# Altium schematic sheet Control.SchDoc
size A; SheetNumber: 1; SheetTotal: 1
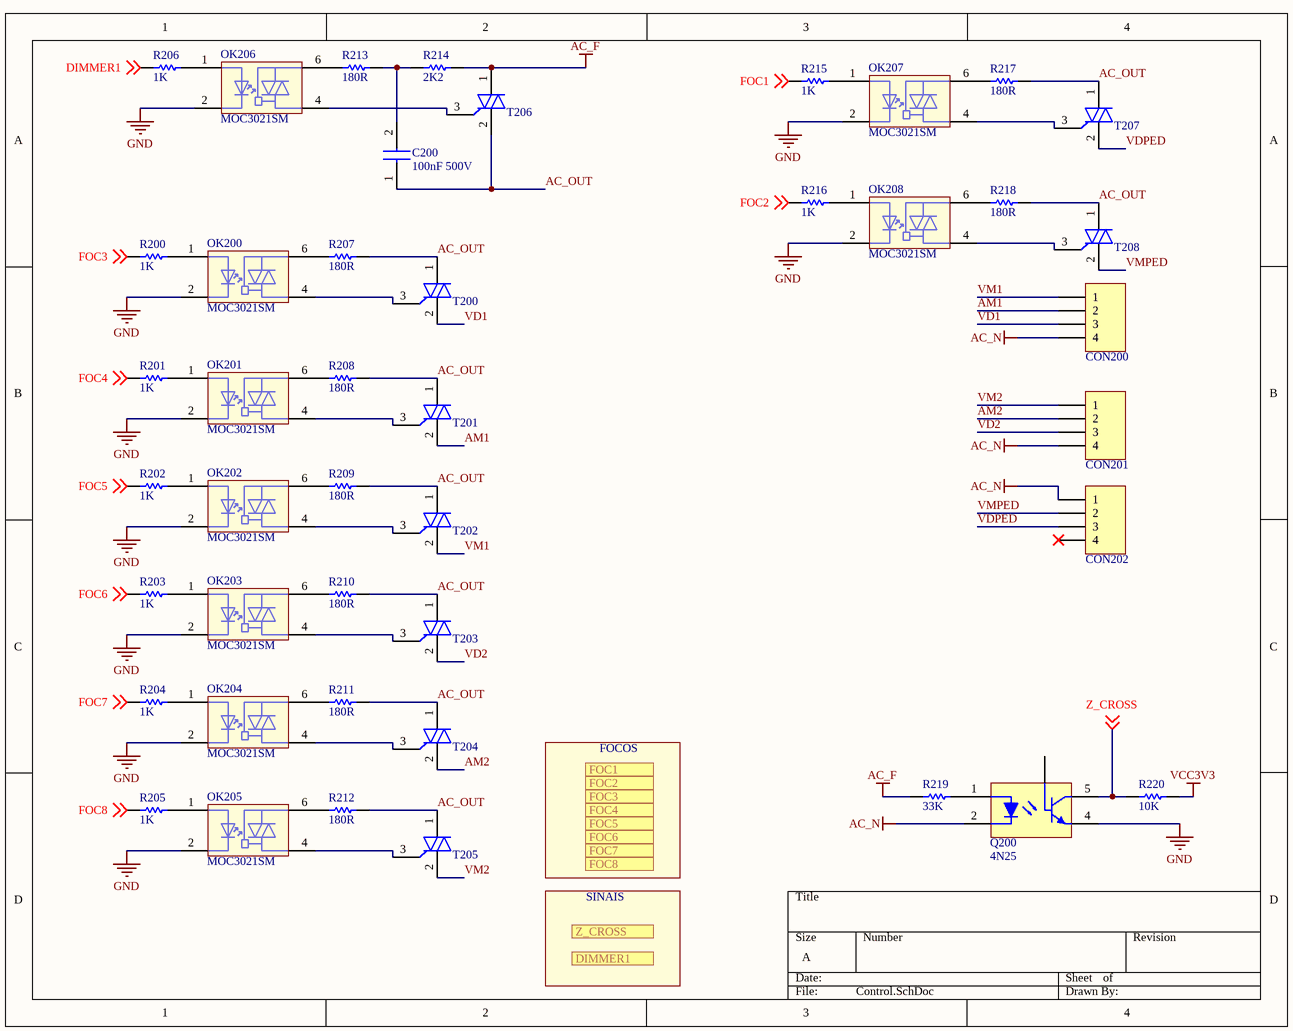
[diagram p0: Control.SchDoc]

## Parts
C200  100nF 500V  [CAPC3225-1210N]
CON200  TERM BLOCK 4POS  [MSTBA 4G]  (value not drawn)
CON201  TERM BLOCK 4POS  [MSTBA 4G]  (value not drawn)
CON202  TERM BLOCK 4POS  [MSTBA 4G]  (value not drawn)
OK200  MOC3021SM  [SOP254P1016X450-6N]
OK201  MOC3021SM  [SOP254P1016X450-6N]
OK202  MOC3021SM  [SOP254P1016X450-6N]
OK203  MOC3021SM  [SOP254P1016X450-6N]
OK204  MOC3021SM  [SOP254P1016X450-6N]
OK205  MOC3021SM  [SOP254P1016X450-6N]
OK206  MOC3021SM  [SOP254P1016X450-6N]
OK207  MOC3021SM  [SOP254P1016X450-6N]
OK208  MOC3021SM  [SOP254P1016X450-6N]
Q200  4N25  [6-SMD]
R200  1K  [CR2012-0805]
R201  1K  [CR2012-0805]
R202  1K  [CR2012-0805]
R203  1K  [CR2012-0805]
R204  1K  [CR2012-0805]
R205  1K  [CR2012-0805]
R206  1K  [CR2012-0805]
R207  180R  [CR2012-0805]
R208  180R  [CR2012-0805]
R209  180R  [CR2012-0805]
R210  180R  [CR2012-0805]
R211  180R  [CR2012-0805]
R212  180R  [CR2012-0805]
R213  180R  [CR2012-0805]
R214  2K2  [CR2012-0805]
R215  1K  [CR2012-0805]
R216  1K  [CR2012-0805]
R217  180R  [CR2012-0805]
R218  180R  [CR2012-0805]
R219  33K  [CR2012-0805]
R220  10K  [CR2012-0805]
T200  BTA12-600BRG  [TO255P460X1020X2005-3P]  (value not drawn)
T201  BTA12-600BRG  [TO255P460X1020X2005-3P]  (value not drawn)
T202  BTA12-600BRG  [TO255P460X1020X2005-3P]  (value not drawn)
T203  BTA12-600BRG  [TO255P460X1020X2005-3P]  (value not drawn)
T204  BTA12-600BRG  [TO255P460X1020X2005-3P]  (value not drawn)
T205  BTA12-600BRG  [TO255P460X1020X2005-3P]  (value not drawn)
T206  BTA12-600BRG  [TO255P460X1020X2005-3P]  (value not drawn)
T207  BTA12-600BRG  [TO255P460X1020X2005-3P]  (value not drawn)
T208  BTA12-600BRG  [TO255P460X1020X2005-3P]  (value not drawn)

## Ports
DIMMER1 (in), FOC1 (in), FOC2 (in), FOC3 (in), FOC4 (in), FOC5 (in), FOC6 (in), FOC7 (in), FOC8 (in), Z_CROSS

## Nets
AC_F: R214.2 R219.1 T206.1(A1)
AC_N: CON200.4 CON201.4 CON202.1 Q200.2(K)
GND: OK200.2(K) OK201.2(K) OK202.2(K) OK203.2(K) OK204.2(K) OK205.2(K) OK206.2(K) OK207.2(K) OK208.2(K) Q200.4(E)
VCC3V3: R220.2
AC_OUT: C200.1 R207.2 R208.2 R209.2 R210.2 R211.2 R212.2 R217.2 R218.2 T200.1(A1) T201.1(A1) T202.1(A1) T203.1(A1) T204.1(A1) T205.1(A1) T206.2(A2) T207.1(A1) T208.1(A1)
AM1: CON200.2 T201.2(A2)
AM2: CON201.2 T204.2(A2)
DIMMER1: R206.1 ; off-sheet DIMMER1
FOC1: R215.1 ; off-sheet FOC1
FOC2: R216.1 ; off-sheet FOC2
FOC3: R200.1 ; off-sheet FOC3
FOC4: R201.1 ; off-sheet FOC4
FOC5: R202.1 ; off-sheet FOC5
FOC6: R203.1 ; off-sheet FOC6
FOC7: R204.1 ; off-sheet FOC7
FOC8: R205.1 ; off-sheet FOC8
VD1: CON200.3 T200.2(A2)
VD2: CON201.3 T203.2(A2)
VDPED: CON202.3 T207.2(A2)
VM1: CON200.1 T202.2(A2)
VM2: CON201.1 T205.2(A2)
VMPED: CON202.2 T208.2(A2)
Z_CROSS: Q200.5(C) R220.1 ; off-sheet Z_CROSS
NetC200_2: C200.2 R213.2 R214.1
NetOK200_1: OK200.1(A) R200.2
NetOK200_4: OK200.4(A/K) T200.3(G)
NetOK200_6: OK200.6(K/A) R207.1
NetOK201_1: OK201.1(A) R201.2
NetOK201_4: OK201.4(A/K) T201.3(G)
NetOK201_6: OK201.6(K/A) R208.1
NetOK202_1: OK202.1(A) R202.2
NetOK202_4: OK202.4(A/K) T202.3(G)
NetOK202_6: OK202.6(K/A) R209.1
NetOK203_1: OK203.1(A) R203.2
NetOK203_4: OK203.4(A/K) T203.3(G)
NetOK203_6: OK203.6(K/A) R210.1
NetOK204_1: OK204.1(A) R204.2
NetOK204_4: OK204.4(A/K) T204.3(G)
NetOK204_6: OK204.6(K/A) R211.1
NetOK205_1: OK205.1(A) R205.2
NetOK205_4: OK205.4(A/K) T205.3(G)
NetOK205_6: OK205.6(K/A) R212.1
NetOK206_1: OK206.1(A) R206.2
NetOK206_4: OK206.4(A/K) T206.3(G)
NetOK206_6: OK206.6(K/A) R213.1
NetOK207_1: OK207.1(A) R215.2
NetOK207_4: OK207.4(A/K) T207.3(G)
NetOK207_6: OK207.6(K/A) R217.1
NetOK208_1: OK208.1(A) R216.2
NetOK208_4: OK208.4(A/K) T208.3(G)
NetOK208_6: OK208.6(K/A) R218.1
NetQ200_1: Q200.1(A) R219.2

Not connected (* = marked no-connect by the designer): CON202 4*; Q200 6(B)

## Notes on the sheet
- FOCOS
- SINAIS

## Library data of the parts
C200 = CAP 100nF 500V C1210C106M6PACTU 1210: CAP CER 0.1UF 500V X7R 1210; Manufacturer_Name: Kemet; Manufacturer Part Number: C1210C104KCRACTU; Dielectric Material: Ceramic; Voltage Rating (DC): 1kV; Tolerance: 10%; Datasheet Link: https://api.kemet.com/component-edge/download/datasheet/C1210C106M6PACTU.pdf; Height: 2.1mm; Manufacturer_Part_Number: C1210C106M6PACTU; Mouser Part Number: 80-C1210C106M6P; Mouser Price/Stock: https://www.mouser.co.uk/ProductDetail/KEMET/C1210C106M6PACTU?qs=K%2Fj%2Fqf%252B0fqKxjJfAWxNdjg%3D%3D; Arrow Part Number: C1210C106M6PACTU; Arrow Price/Stock: https://www.arrow.com/en/products/c1210c106m6pactu/kemet-corporation; Supplier 1: LCSC; Manufacturer: KEMET; RoHS: Yes; Category: Ceramic Capacitors; Stock 1: 12082; Pricing 1: 1=0,22980, 10=0,17550, 30=0,16550, 100=0,15550, 500=0,15110, 1000=0,14890, 1=0,22120, 10=0,16900, 30=0,15930, 100=0,14970, 500=0,14540, 1000=0,14330, 1=1,15440, 10=0,88170, 30=0,83110, 100=0,78120, 500=0,75890, 1000=0,74770, 1=1,10970, 10=0,84760, 30=0,79900, 100=0,75100, 500=0,72950, 1000=0,71880, 1=0,14920, 10=0,11400, 30=0,10740, 100=0,10100, 500=0,09810, 1000=0,09670, 1=0,12760, 10=0,09740, 30=0,09180, 100=0,08630, 500=0,08390, 1000=0,08260, 1=1,36580, 10=1,04320, 30=0,98340, 100=0,92430, 500=0,89790, 1000=0,88460, 1=19,30340, 10=14,74390, 30=13,89800, 100=13,06300, 500=12,68950, 1000=12,50270, 1=0,72810, 10=0,55610, 30=0,52420, 100=0,49270, 500=0,47860, 1000=0,47160, 1=13,29180, 10=10,15230, 30=9,56980, 100=8,99480, 500=8,73760, 1000=8,60900, 1=1,52590, 10=1,16550, 30=1,09860, 100=1,03260, 500=1,00310, 1000=0,98830, 1=0,23690, 10=0,18090, 30=0,17050, 100=0,16030, 500=0,15570, 1000=0,15340, 1=0,17570, 10=0,13420, 30=0,12650, 100=0,11890, 500=0,11550, 1000=0,11380 (AUD); Mount: Surface Mount; Case/Package: 1210; Case Code (Imperial): 1210; Case Code (Metric): 3225; Contact Plating: Tin,Matte; Min Operating Temperature: -55°C; Max Operating Temperature: 125°C; Package Quantity: 1; Voltage Rating: 500V; Packaging: Tape and Reel; Capacitance: 100nF; Dielectric: X7R; Termination: SMD/SMT; Series: C; Length: 3.2mm; Width: 2.5mm; Thickness: 0.091inch; Depth: 2.5mm; REACH SVHC: No SVHC; RoHS Compliant: Yes; ComponentLink1URL: https://datasheet.ciiva.com/5409/kem-c1010-x7r-hv-smd-5409158.pdf?src-supplier=Mouser; ComponentLink1Description: https://datasheet.ciiva.com/5409/kem-c1010-x7r-hv-smd-5409158.pdf?src-supplier=Mouser; Supplier Part Number 1: C141218
CON200-CON202 = TERM BLOCK HEADER 4POS R/A 5.08MM: TERM BLOCK HDR 4POS R/A 5.08MM; ComponentLink1URL: http://media.digikey.com/pdf/Data%20Sheets/Phoenix%20Contact%20PDFs/1757242.pdf; ComponentLink1Description: http://media.digikey.com/pdf/Data%20Sheets/Phoenix%20Contact%20PDFs/1757242.pdf
OK200-OK208 = OPTOISO Triac MOC3021SM SOP6N: OPTOCOUPLERS SMD-6 ROHS; Manufacturer_Name: Isocom; Manufacturer Part Number: OR-MOC3021S; Manufacturer: Orient Technology; Datasheet Link: https://datasheet.datasheetarchive.com/originals/distributors/Datasheets-313/192003.pdf; Height: 4.5mm; Manufacturer_Part_Number: MOC3021SM; Arrow Part Number: MOC3021SM; Arrow Price/Stock: https://www.arrow.com/en/products/moc3021sm/isocom; Supplier 1: LCSC; Supplier Part Number 1: C370899
Q200 = OPTOISO 4N25S 2.5KV TRANS W/BASE 6SMD: OPTOISO 4.17KV TRANS W/BASE 6SMD; Manufacturer: ON Semiconductor; Manufacturer Part Number: 4N25SR2M; Max Power Dissipation: 250mW; Supplier 1: Digi-Key; RoHS: No; Category: Optocouplers; Stock 1: 12901; Pricing 1: 1=0,73000, 10=0,57000, 100=0,36570, 500=0,31448 (USD); ComponentLink1URL: http://www.farnell.com/datasheets/2287881.pdf?src-supplier=Farnell; ComponentLink1Description: http://www.farnell.com/datasheets/2287881.pdf?src-supplier=Farnell; ComponentLink2URL: https://produktinfo.conrad.com/datenblaetter/1200000-1299999/001265459-da-01-en-OPTOISOLATOR_TRANS_7__4N25SR2M_SMD_6_ONS.PDF?src-supplier=Conrad; ComponentLink2Description: https://produktinfo.conrad.com/datenblaetter/1200000-1299999/001265459-da-01-en-OPTOISOLATOR_TRANS_7__4N25SR2M_SMD_6_ONS.PDF?src-supplier=Conrad; ComponentLink3URL: http://www.onsemi.com/pub/Collateral/4N37M-D.pdf?src-supplier=Digi-Key; ComponentLink3Description: http://www.onsemi.com/pub/Collateral/4N37M-D.pdf?src-supplier=Digi-Key; ComponentLink4URL: http://www.farnell.com/datasheets/2287881.pdf?src-supplier=Newark; ComponentLink4Description: http://www.farnell.com/datasheets/2287881.pdf?src-supplier=Newark; ComponentLink5URL: https://www.fairchildsemi.com/datasheets/4N/4N25M.pdf?src-supplier=Digi-Key; ComponentLink5Description: https://www.fairchildsemi.com/datasheets/4N/4N25M.pdf?src-supplier=Digi-Key; Supplier Part Number 1: 4N25SR2MCT-ND; Lead Free: Lead Free; Power Dissipation: 250mW; Case/Package: SMD/SMT; Package Quantity: 1000; Supplier 2: LCSC; Supplier Part Number 2: C143074
R200-R206 R215 R216 = RES 1K OHM 1% 1/8W 0805 SMD: RES SMD 1K OHM 1% 1/8W 0805; Manufacturer: Yageo; Manufacturer Part Number: RC0805FR-071KL; Resistance: 1kR; Voltage Rating (DC): 150V; Temperature Coefficient: 100ppm/°C; Power Rating: 125mW; ComponentLink1URL: http://media.digikey.com/pdf/Data%20Sheets/Rohm%20PDFs/MCR10%20(new)%20series.pdf; ComponentLink1Description: http://media.digikey.com/pdf/Data%20Sheets/Rohm%20PDFs/MCR10%20(new)%20series.pdf; RoHS: Yes; Category: Chip SMD Resistors; Stock 1: 24108233; Pricing 1: 1=0,10000, 10=0,04000, 100=0,01630, 1000=0,00731, 2500=0,00635 (USD); Case/Package: 0805; Number of Pins: 2; Case Code (Metric): 2012; Case Code (Imperial): 0805; Min Operating Temperature: -55°C; Max Operating Temperature: 155°C; Tolerance: 1%; Packaging: Tape and Reel; Composition: Thick Film; Package Quantity: 1; Voltage Rating: 150V; Number of Terminations: 2; Termination: SMD/SMT; Military Standard: Not; Max Power Dissipation: 125mW; Features: Moisture Resistant; Length: 0.079inch; Height: 0.024inch; Width: 0.049inch; Depth: 1.25mm; REACH SVHC: Unknown; Lead Free: Lead Free; ComponentLink2URL: https://datasheet.ciiva.com/2456/pyu-r-int-thick-7-2456976.pdf?src-supplier=Digi-Key; ComponentLink2Description: https://datasheet.ciiva.com/2456/pyu-r-int-thick-7-2456976.pdf?src-supplier=Digi-Key; ComponentLink3URL: https://datasheet.ciiva.com/2456/pyu-r-int-thick-7-2456977.pdf?src-supplier=Digi-Key; ComponentLink3Description: https://datasheet.ciiva.com/2456/pyu-r-int-thick-7-2456977.pdf?src-supplier=Digi-Key; ComponentLink4URL: https://datasheet.ciiva.com/7941/1686128-7941719.pdf?src-supplier=Element14; ComponentLink4Description: https://datasheet.ciiva.com/7941/1686128-7941719.pdf?src-supplier=Element14; ComponentLink5URL: https://datasheet.ciiva.com/16850/rc0805-16850409.pdf?src-supplier=Future+Electronics; ComponentLink5Description: https://datasheet.ciiva.com/16850/rc0805-16850409.pdf?src-supplier=Future+Electronics; ComponentLink6URL: https://datasheet.ciiva.com/46385/444164-46385020.pdf?src-supplier=Element14; ComponentLink6Description: https://datasheet.ciiva.com/46385/444164-46385020.pdf?src-supplier=Element14; ComponentLink7URL: https://datasheet.ciiva.com/2456/pyu-r-int-thick-7-2456975.pdf?src-supplier=Digi-Key; ComponentLink7Description: https://datasheet.ciiva.com/2456/pyu-r-int-thick-7-2456975.pdf?src-supplier=Digi-Key; Supplier 1: Digi-Key; Supplier 2: LCSC; Supplier Part Number 1: 311-1.00KCRDKR-ND; Supplier Part Number 2: C17513
R207-R213 R217 R218 = RES 180R 1/8W 5% 0805 SMD: RES 180 OHM 1/8W 5% 0805 SMD; Manufacturer: Uniroyal; Manufacturer Part Number: 0805W8J0181T5E; Resistance (Ohms): 180; Power (Watts): 0.125W, 1/8W; Temperature Coefficient: ±200ppm/°C; Supplier 1: Digi-Key; RoHS: RoHS Compliant; Category: Resistors; Stock 1: 114196; Pricing 1: 1=0.1, 10=0.025, 25=0.018, 50=0.0136, 100=0.01, 250=0.00764, 500=0.00612, 1000=0.00451 (USD); Packaging: Cut Tape (CT); Part Status: Active; Tolerance: ±5%; Composition: Thick Film; Features: Automotive AEC-Q200; Operating Temperature: -55°C ~ 155°C; Package / Case: 0805 (2012 Metric); Supplier Device Package: 0805; Size / Dimension: 0.079" L x 0.049" W (2.00mm x 1.25mm); Height - Seated (Max): 0.028" (0.70mm); Failure Rate: -; ComponentLink1URL: http://industrial.panasonic.com/www-cgi/jvcr13pz.cgi?E+PZ+3+AOA0001+ERJ6GEYJ181V+7+WW; ComponentLink1Description: http://industrial.panasonic.com/www-cgi/jvcr13pz.cgi?E+PZ+3+AOA0001+ERJ6GEYJ181V+7+WW; Supplier Part Number 1: P180ACT-ND; Supplier 2: LCSC; Supplier Part Number 2: C1339
R214 = RES 2K2 OHM 1/8W 5% 0805 SMD: RES SMD 2.2K OHM 5% 1/8W 0805; Manufacturer: Panasonic Electronic Components; Part#: ERJ-6GEYJ222V; eVendor: Digi-Key; eVendorPrice: 0,10; eVendor#: P2.2KACT-ND; MSRP: 0,00459; Power (Watts): 0.125W, 1/8W; Temperature Coefficient: ±200ppm/°C; Datasheet: http://industrial.panasonic.com/www-cgi/jvcr13pz.cgi?E+PZ+3+AOA0001+ERJ6GEYJ222V+7+WW; MOQ: 2500; Obs: ERJ-6GEYJ222V; Supplier 1: Digi-Key; Manufacturer Part Number: ERJ-6GEYJ222V; RoHS: RoHS Compliant; Category: Resistors; Stock 1: 100522; Pricing 1: 1=0.1, 10=0.025, 25=0.018, 50=0.0136, 100=0.01, 250=0.00764, 500=0.00612, 1000=0.00451 (USD); Packaging: Cut Tape (CT); Part Status: Active; Resistance (Ohms): 2.2k; Tolerance: ±5%; Composition: Thick Film; Features: Automotive AEC-Q200; Operating Temperature: -55°C ~ 155°C; Package / Case: 0805 (2012 Metric); Supplier Device Package: 0805; Size / Dimension: 0.079" L x 0.049" W (2.00mm x 1.25mm); Height - Seated (Max): 0.028" (0.70mm); Number of Terminations: 2; Failure Rate: -; ComponentLink1URL: http://industrial.panasonic.com/www-cgi/jvcr13pz.cgi?E+PZ+3+AOA0001+ERJ6GEYJ222V+7+WW; ComponentLink1Description: http://industrial.panasonic.com/www-cgi/jvcr13pz.cgi?E+PZ+3+AOA0001+ERJ6GEYJ222V+7+WW; Supplier Part Number 1: P2.2KACT-ND; Supplier 2: LCSC; Supplier Part Number 2: C17520
R219 = RES 33K OHM 5% 1/8W 0805 SMD: RES SMD 33K OHM 5% 1/8W 0805; Manufacturer: Uniroyal; Manufacturer Part Number: 0805W8J0333T5E; Power (Watts): 0.125W, 1/8W; Temperature Coefficient: ±200ppm/°C; Supplier 1: Digi-Key; RoHS: RoHS Compliant; Category: Resistors; Stock 1: 8707; Pricing 1: 1=0.1, 10=0.015, 25=0.0112, 50=0.0084, 100=0.0063, 250=0.00476, 500=0.00382, 1000=0.00281 (USD); Packaging: Cut Tape (CT); Part Status: Active; Resistance (Ohms): 33k; Tolerance: ±5%; Composition: Thick Film; Features: -; Operating Temperature: -55°C ~ 155°C; Package / Case: 0805 (2012 Metric); Supplier Device Package: 0805; Size / Dimension: 0.079" L x 0.049" W (2.00mm x 1.25mm); Height - Seated (Max): 0.026" (0.65mm); Failure Rate: -; ComponentLink1URL: http://rohmfs.rohm.com/en/products/databook/datasheet/passive/resistor/chip_resistor/mcr_g.pdf; ComponentLink1Description: http://rohmfs.rohm.com/en/products/databook/datasheet/passive/resistor/chip_resistor/mcr_g.pdf; Supplier Part Number 1: RHM33KCPCT-ND; Supplier 2: LCSC; Supplier Part Number 2: C25630
R220 = RES 10K OHM 1% 1/8W 0805 SMD: RES 0805 10K Ohm 0.1% 1/10W  SMD; Manufacturer: Panasonic Electronic Components; Manufacturer Part Number: ERJ-6ENF1002V; Tolerance: ±1%; Power (Watts): 0.125W, 1/8W; Temperature Coefficient: ±100ppm/°C; Resistance: 10kR; Power Rating: 100mW; Voltage Rating (DC): 150V; Max Power Dissipation: 125mW; Number of Resistors: 1; RoHS: RoHS Compliant; Category: Resistors; Stock 1: 2392770; Pricing 1: 1=0.1, 10=0.036, 25=0.0264, 50=0.02, 100=0.0148, 250=0.01124, 500=0.009, 1000=0.00663 (USD); Packaging: Cut Tape (CT); Part Status: Active; Resistance (Ohms): 10k; Composition: Thick Film; Features: Automotive AEC-Q200; Operating Temperature: -55°C ~ 155°C; Package / Case: 0805 (2012 Metric); Supplier Device Package: 0805; Size / Dimension: 0.079" L x 0.049" W (2.00mm x 1.25mm); Height - Seated (Max): 0.028" (0.70mm); Number of Terminations: 2; Failure Rate: -; ComponentLink1URL: https://industrial.panasonic.com/cdbs/www-data/pdf/RDA0000/AOA0000C283.pdf; ComponentLink1Description: https://industrial.panasonic.com/cdbs/www-data/pdf/RDA0000/AOA0000C283.pdf; Stock 2: 1650; Pricing 2: 1=1,68000, 10=1,48900, 100=1,13720, 1000=0,73645 (USD); Mount: Surface Mount; Case/Package: 0805; Number of Pins: 2; Case Code (Metric): 2012; Case Code (Imperial): 0805; Contact Plating: Tin; Min Operating Temperature: -55°C; Max Operating Temperature: 155°C; Voltage Rating: 150V; Package Quantity: 5000; Termination: SMD/SMT; Military Standard: Not; Working Voltage: 150V; Length: 2mm; Height: 0.6mm; Width: 0.049inch; Depth: 1.25mm; Radiation Hardening: No; REACH SVHC: No SVHC; Lead Free: Lead Free; ComponentLink2URL: https://datasheet.ciiva.com/11808/0900766b80f80784-11808080.pdf?src-supplier=RSComponents; ComponentLink2Description: https://datasheet.ciiva.com/11808/0900766b80f80784-11808080.pdf?src-supplier=RSComponents; ComponentLink3URL: https://datasheet.ciiva.com/16514/aoa0000ce2-16514021.pdf?src-supplier=Avnet+Asia; ComponentLink3Description: https://datasheet.ciiva.com/16514/aoa0000ce2-16514021.pdf?src-supplier=Avnet+Asia; ComponentLink4URL: https://datasheet.ciiva.com/27055/1988971-27055733.pdf?src-supplier=Jameco; ComponentLink4Description: https://datasheet.ciiva.com/27055/1988971-27055733.pdf?src-supplier=Jameco; ComponentLink5URL: https://datasheet.ciiva.com/16759/70260748-16759350.pdf?src-supplier=Allied+Electronics; ComponentLink5Description: https://datasheet.ciiva.com/16759/70260748-16759350.pdf?src-supplier=Allied+Electronics; ComponentLink6URL: https://datasheet.ciiva.com/16725/70260748-16725031.pdf?src-supplier=Allied+Electronics; ComponentLink6Description: https://datasheet.ciiva.com/16725/70260748-16725031.pdf?src-supplier=Allied+Electronics; ComponentLink7URL: https://datasheet.ciiva.com/46372/1678782-46372714.pdf?src-supplier=Element14; ComponentLink7Description: https://datasheet.ciiva.com/46372/1678782-46372714.pdf?src-supplier=Element14; ComponentLink8URL: https://datasheet.ciiva.com/46372/1678782-46372715.pdf?src-supplier=Element14; ComponentLink8Description: https://datasheet.ciiva.com/46372/1678782-46372715.pdf?src-supplier=Element14; ComponentLink9URL: https://datasheet.ciiva.com/7830/426256-7830745.pdf?src-supplier=Element14; ComponentLink9Description: https://datasheet.ciiva.com/7830/426256-7830745.pdf?src-supplier=Element14; ComponentLink10URL: https://datasheet.ciiva.com/17212/aoa0000ce2-17212108.pdf?src-supplier=Avnet+Europe; ComponentLink10Description: https://datasheet.ciiva.com/17212/aoa0000ce2-17212108.pdf?src-supplier=Avnet+Europe; ComponentLink11URL: https://datasheet.ciiva.com/30140/aoa0000ce2-30140236.pdf?src-supplier=Onlinecomponents.com; ComponentLink11Description: https://datasheet.ciiva.com/30140/aoa0000ce2-30140236.pdf?src-supplier=Onlinecomponents.com; ComponentLink12URL: https://datasheet.ciiva.com/24070/aoa0000ce2-24070702.pdf?src-supplier=Mouser; ComponentLink12Description: https://datasheet.ciiva.com/24070/aoa0000ce2-24070702.pdf?src-supplier=Mouser; ELV: Compliant; ComponentLink13URL: https://datasheet.ciiva.com/16723/70063741-16723029.pdf?src-supplier=Allied+Electronics; ComponentLink13Description: https://datasheet.ciiva.com/16723/70063741-16723029.pdf?src-supplier=Allied+Electronics; ComponentLink14URL: https://datasheet.ciiva.com/24440/eng-ds-1773270-l-24440188.pdf?src-supplier=Onlinecomponents.com; ComponentLink14Description: https://datasheet.ciiva.com/24440/eng-ds-1773270-l-24440188.pdf?src-supplier=Onlinecomponents.com; ComponentLink15URL: https://datasheet.ciiva.com/7731/eng-ds-1773270-l-7731311.pdf?src-supplier=Element14; ComponentLink15Description: https://datasheet.ciiva.com/7731/eng-ds-1773270-l-7731311.pdf?src-supplier=Element14; ComponentLink16URL: https://datasheet.ciiva.com/14181/jcrn73-data-e-14181423.pdf?src-supplier=Distrelec; ComponentLink16Description: https://datasheet.ciiva.com/14181/jcrn73-data-e-14181423.pdf?src-supplier=Distrelec; Supplier 1: Digi-Key; Supplier Part Number 1: A105823-ND; Supplier 2: Digi-Key; Supplier Part Number 2: P10KACT-ND; Resistance Tolerance: 0.1%; Resistor Type: Thin Film; Supplier 3: LCSC; Supplier Part Number 3: C17414
T200-T208 = THIRISTOR  TRIAC BTA12-600BRG TO220: Thyristor TRIAC 600V 126A 3-Pin(3+Tab) TO-220AB Insulated Tube; Manufacturer_Name: STMicroelectronics; Hold Current: 50mA; RMS Current (Irms): 12A; Element Configuration: Single; Datasheet Link: http://www.st.com/web/en/resource/technical/document/datasheet/CD00002267.pdf; Height: 4.6mm; Manufacturer_Part_Number: BTA12-600BRG; Mouser Part Number: 511-BTA12-600B; Mouser Price/Stock: https://www.mouser.co.uk/ProductDetail/STMicroelectronics/BTA12-600BRG/?qs=giOUUUQrSzKZwChWaBwGpA%3D%3D; Arrow Part Number: BTA12-600BRG; Arrow Price/Stock: https://www.arrow.com/en/products/bta12-600brg/stmicroelectronics; Supplier 1: LCSC; Manufacturer: STMicroelectronics; Manufacturer Part Number: BTA12-600BRG; RoHS: Yes; Category: TRIACs; Stock 1: 4527; Pricing 1: 1=0,84210, 10=0,62980, 30=0,59210, 100=0,55430, 500=0,53550, 1000=0,52840, 1=0,81060, 10=0,60630, 30=0,57000, 100=0,53360, 500=0,51550, 1000=0,50870, 1=4,23000, 10=3,16360, 30=2,97440, 100=2,78450, 500=2,68990, 1000=2,65440, 1=4,06630, 10=3,04120, 30=2,85930, 100=2,67680, 500=2,58580, 1000=2,55170, 1=0,54680, 10=0,40900, 30=0,38450, 100=0,36000, 500=0,34770, 1000=0,34310, 1=0,46740, 10=0,34960, 30=0,32870, 100=0,30770, 500=0,29720, 1000=0,29330, 1=5,00460, 10=3,74300, 30=3,51910, 100=3,29450, 500=3,18250, 1000=3,14050, 1=70,73140, 10=52,90020, 30=49,73610, 100=46,56100, 500=44,97890, 1000=44,38570, 1=2,66790, 10=1,99530, 30=1,87600, 100=1,75620, 500=1,69650, 1000=1,67420, 1=48,70380, 10=36,42570, 30=34,24700, 100=32,06070, 500=30,97130, 1000=30,56280, 1=5,59110, 10=4,18160, 30=3,93150, 100=3,68050, 500=3,55550, 1000=3,50860, 1=0,86790, 10=0,64910, 30=0,61030, 100=0,57130, 500=0,55190, 1000=0,54460, 1=0,64380, 10=0,48150, 30=0,45270, 100=0,42380, 500=0,40940, 1000=0,40400 (AUD); Mount: Through Hole; Case/Package: TO-220AB; Number of Pins: 3; Weight: 0.211644oz; Contact Plating: Tin,Matte; Min Operating Temperature: -40°C; Max Operating Temperature: 125°C; Max Repetitive Reverse Voltage (Vrrm): 600V; Packaging: Rail/Tube; Package Quantity: 50; Current Rating: 12A; Voltage Rating (DC): 600V; Series: BTA12; Length: 10.4mm; Width: 4.6mm; Radiation Hardening: No; RoHS Compliant: Yes; REACH SVHC: No SVHC; Lead Free: Lead Free; ComponentLink1URL: https://datasheet.ciiva.com/14164/bta12-eng-tds-14164177.pdf?src-supplier=Distrelec; ComponentLink1Description: https://datasheet.ciiva.com/14164/bta12-eng-tds-14164177.pdf?src-supplier=Distrelec; ComponentLink2URL: https://datasheet.ciiva.com/15140/getdatasheetpartid-146661-15140538.pdf?src-supplier=Verical; ComponentLink2Description: https://datasheet.ciiva.com/15140/getdatasheetpartid-146661-15140538.pdf?src-supplier=Verical; ComponentLink3URL: https://datasheet.ciiva.com/3053/cd00002267-3053549.pdf?src-supplier=Avnet; ComponentLink3Description: https://datasheet.ciiva.com/3053/cd00002267-3053549.pdf?src-supplier=Avnet; ComponentLink4URL: https://datasheet.ciiva.com/4749/cd00002267-4749019.pdf?src-supplier=Mouser; ComponentLink4Description: https://datasheet.ciiva.com/4749/cd00002267-4749019.pdf?src-supplier=Mouser; ComponentLink5URL: https://datasheet.ciiva.com/1197/1717978-1197123.pdf?src-supplier=Element14; ComponentLink5Description: https://datasheet.ciiva.com/1197/1717978-1197123.pdf?src-supplier=Element14; ComponentLink6URL: https://datasheet.ciiva.com/25889/cd00002267-25889495.pdf?src-supplier=Avnet+Europe; ComponentLink6Description: https://datasheet.ciiva.com/25889/cd00002267-25889495.pdf?src-supplier=Avnet+Europe; Supplier Part Number 1: C10063